# Altium schematic sheet Esquematico.SchDoc
size A4 portrait; SheetNumber: 1; SheetTotal: 1; ENG_APP_DATE: --/--/--; DSN_APP_DATE: --/--/--; CHK_APP_DATE: --/--/--
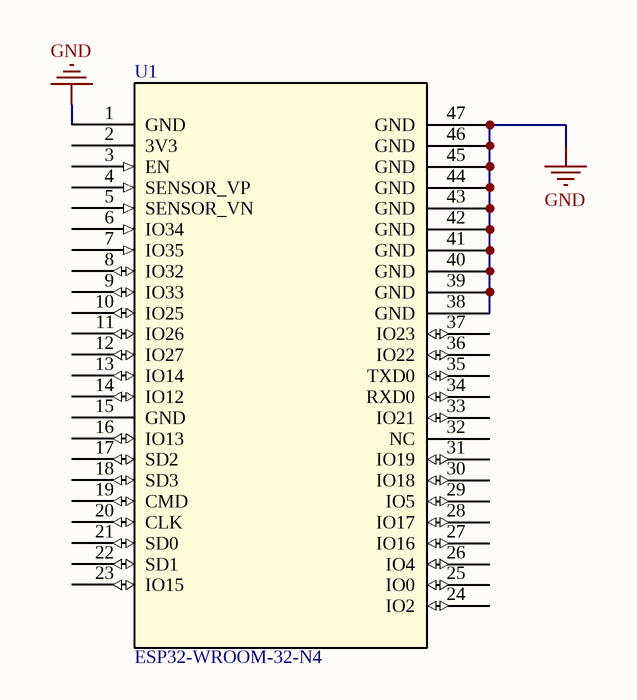
[diagram p0: Esquematico.SchDoc]

## Parts
U1  ESP32-WROOM-32-N4  [MOD_ESP32-WROOM-32_EXP]

## Nets
GND: U1.1(GND) U1.38(GND) U1.39(GND) U1.40(GND) U1.41(GND) U1.42(GND) U1.43(GND) U1.44(GND) U1.45(GND) U1.46(GND) U1.47(GND)

Not connected (* = marked no-connect by the designer): U1 2(3V3) 3(EN) 4(SENSOR_VP) 5(SENSOR_VN) 6(IO34) 7(IO35) 8(IO32) 9(IO33) 10(IO25) 11(IO26) 12(IO27) 13(IO14) 14(IO12) 15(GND) 16(IO13) 17(SD2) 18(SD3) 19(CMD) 20(CLK) 21(SD0) 22(SD1) 23(IO15) 24(IO2) 25(IO0) 26(IO4) 27(IO16) 28(IO17) 29(IO5) 30(IO18) 31(IO19) 32(NC) 33(IO21) 34(RXD0) 35(TXD0) 36(IO22) 37(IO23)

## Notes on the sheet
- Title:
- Projeto IMU - FCTS
- Drawn By:
- Page Contents:
- Davi Ismael
- Checked By:
- 1.0
- Universidade de Brasília
- PCTec
- Brasília - DF
- BEM TE VI
- Size:
- Date:
- File:
- License:
- Email:
- A4
- davi.ismael.406@gmail.com
- Number:
- Time:
- Revision:
- Sheet
- Website:
- of
- https://bemtevi.unb.br/
- https://github.com/userDAVI/FCTS

## Library data of the parts
U1 = ESP32-WROOM-32-N4: No Description Available; Mfr_Name: Espressif Systems; Type: RF; RefDes: RefDes; Supplier 1: Digikey; Supplier Part Number 1: 1965-ESP32-WROOM-32-N4DKR-ND